# EasyEDA Pro project ESPDAP.epro

# Schematic Schematic2
Board Name: Version2; Create Date: 2025-06-18; Page Name: P1_1; Project Name: ESP_DAPLink; Schematic Name: Schematic2; Update Date: 2025-06-27; Company: 嘉立创EDA; Page Size: A4; Version: V1.0
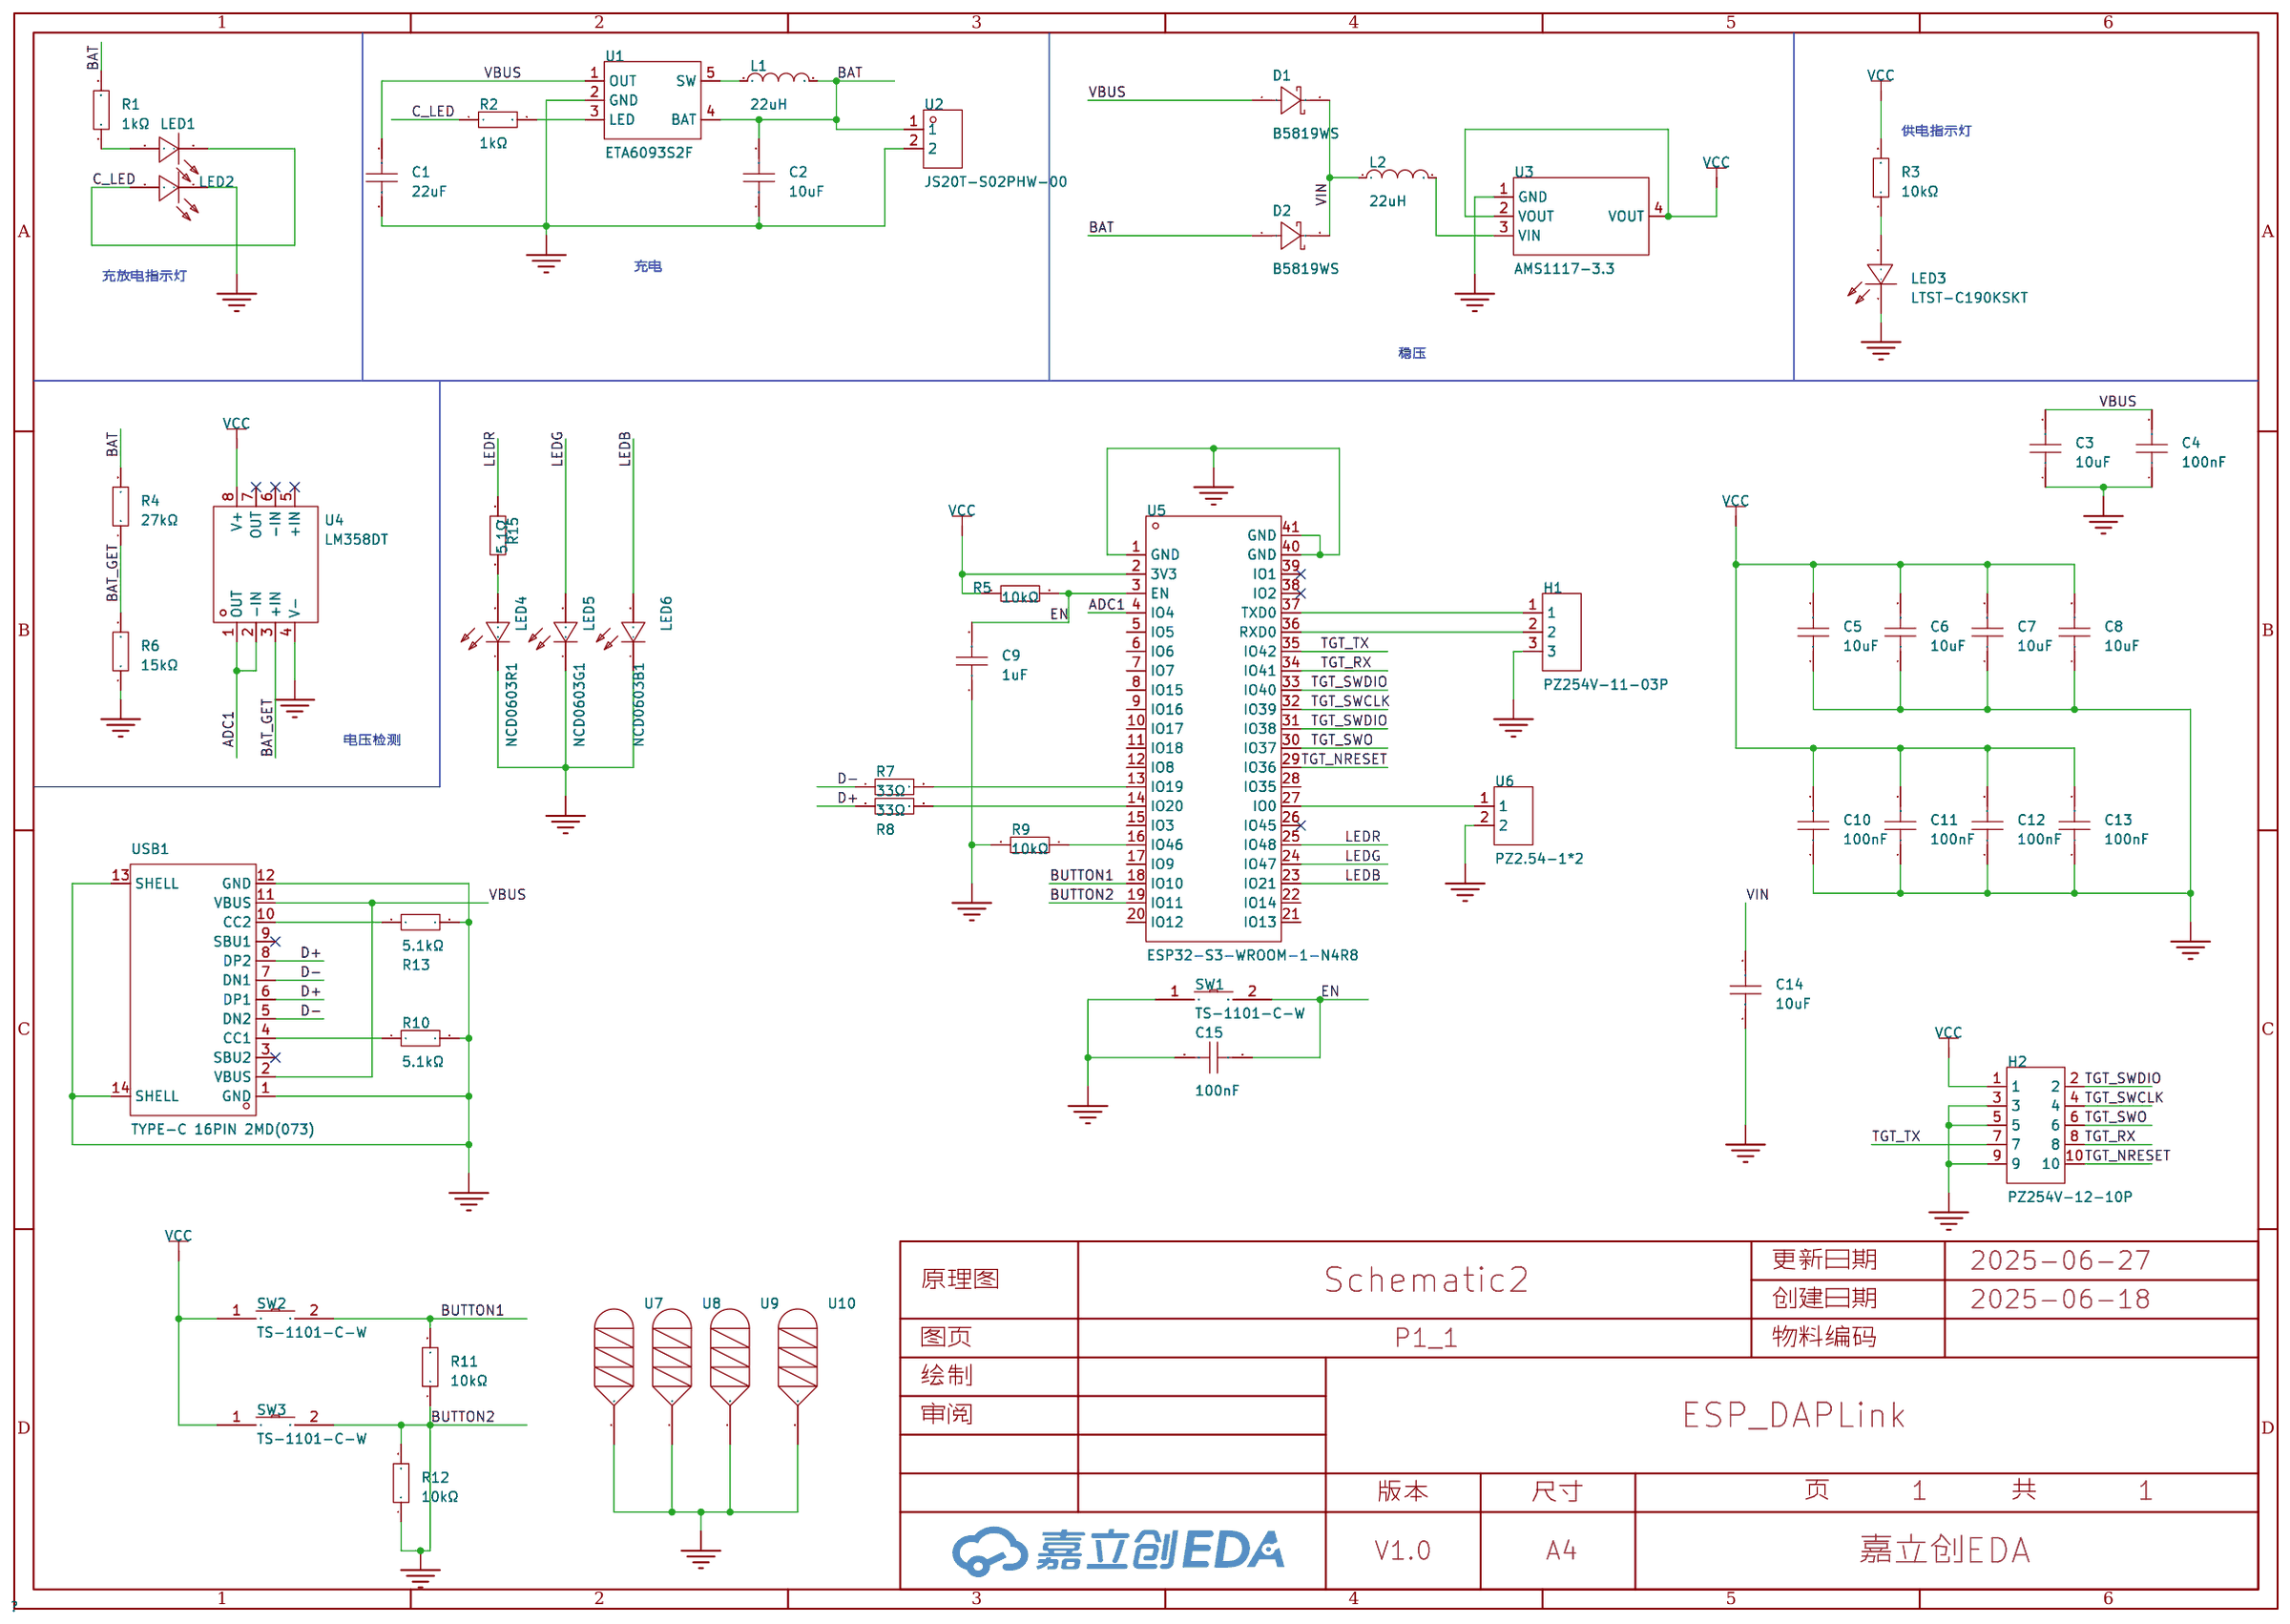
[diagram p0: schematic sheet]

## Parts
C1  22uF  [C0603]
C2  10uF  [C0603]
C3  10uF  [C0603]
C4  100nF  [C0603]
C5  10uF  [C0603]
C6  10uF  [C0603]
C7  10uF  [C0603]
C8  10uF  [C0603]
C9  1uF  [C0603]
C10  100nF  [C0603]
C11  100nF  [C0603]
C12  100nF  [C0603]
C13  100nF  [C0603]
C14  10uF  [C0603]
C15  100nF  [C0603]
D1  B5819WS  [SOD-323_L1.7-W1.3-LS2.5-FD]
D2  B5819WS  [SOD-323_L1.7-W1.3-LS2.5-FD]
H1  PZ254V-11-03P  [HDR-TH_3P-P2.54-V-M]
H2  PZ254V-12-10P  [HDR-TH_10P-P2.54-V-M-R2-C5-S2.54]
L1  22uH  [IND-SMD_L2.5-W2.0_MHCHL2520]
L2  22uH  [IND-SMD_L2.5-W2.0_MHCHL2520]
LED1  LTST-C190KSKT  [LED0603-RD]
LED2  LTST-C190KSKT  [LED0603-RD]
LED3  LTST-C190KSKT  [LED0603-RD]
LED4  NCD0603R1  [LED0603-RD_RED]
LED5  NCD0603G1  [LED0603-RD_1]
LED6  NCD0603B1  [LED0603-RD]
R1  1kΩ  [R0603]
R2  1kΩ  [R0603]
R3  10kΩ  [R0603]
R4  27kΩ  [R0603]
R5  10kΩ  [R0603]
R6  15kΩ  [R0603]
R7  33Ω  [R0603]
R8  33Ω  [R0603]
R9  10kΩ  [R0603]
R10  5.1kΩ  [R0603]
R11  10kΩ  [R0603]
R12  10kΩ  [R0603]
R13  5.1kΩ  [R0603]
R15  5.1Ω  [R0603]
SW1  TS-1101-C-W  [SW-SMD_L6.0-W3.3-LS8.0]
SW2  TS-1101-C-W  [SW-SMD_L6.0-W3.3-LS8.0]
SW3  TS-1101-C-W  [SW-SMD_L6.0-W3.3-LS8.0]
U1  ETA6093S2F  [SOT-23-5_L2.9-W1.6-P0.95-LS2.8-BL]
U2  JS20T-S02PHW-00  [CONN-TH_JS20T-S02PHW-00]
U3  AMS1117-3.3  [SOT-223-3_L6.5-W3.4-P2.30-LS7.0-BR]
U4  LM358DT  [SOIC-8_L5.0-W4.0-P1.27-LS6.0-BL]
U5  ESP32-S3-WROOM-1-N4R8  [WIRELM-SMD_ESP32-S3-WROOM-1]
U6  PZ2.54-1*2  [HDR-TH_2P-P2.54-V-M-3]
U7  -  [M2安装孔]
U8  -  [M2安装孔]
U9  -  [M2安装孔]
U10  -  [M2安装孔]
USB1  TYPE-C 16PIN 2MD(073)  [USB-C-SMD_TYPE-C-6PIN-2MD-073]

## Library data of the parts
C1 = CGA0603X5R226M160JT: 容值:22uF;精度:±20%;额定电压:16V;温度系数:X5R;; LCSC Part Name: 22uF ±20% 16V; Supplier Part: C6119868; Manufacturer: HRE(芯声); Supplier Footprint: 0603; JLCPCB Part Class: 扩展库; Datasheet: https://atta.szlcsc.com/upload/public/pdf/source/20250121/36E435B8815E1026A710792D223DB526.pdf; Supplier: LCSC; Tolerance: ±20%; Voltage Rating: 16V; Temperature Coefficient: X5R
C2 C3 C5-C8 C14 = CGA0603X5R106K100JT: 容值:10uF;精度:±10%;额定电压:10V;温度系数:X5R;; LCSC Part Name: 10uF ±10% 10V; Supplier Part: C6119842; Manufacturer: HRE(芯声); Supplier Footprint: 0603; JLCPCB Part Class: 扩展库; Supplier: LCSC; Tolerance: ±10%; Voltage Rating: 10V; Temperature Coefficient: X5R
C4 C10-C13 C15 = CGA0603X7R104K500JT: 容值:100nF;精度:±10%;额定电压:50V;温度系数:X7R;; LCSC Part Name: 100nF ±10% 50V; Supplier Part: C6119867; Manufacturer: HRE(芯声); Supplier Footprint: 0603; JLCPCB Part Class: 扩展库; Datasheet: https://atta.szlcsc.com/upload/public/pdf/source/20250103/C44077DA9E7B3EFAE02F22B6D3D1CBC9.pdf; Supplier: LCSC; Tolerance: ±10%; Voltage Rating: 50V; Temperature Coefficient: X7R
C9 = CGA0603X5R105K500JT: 容值:1uF;精度:±10%;额定电压:50V;温度系数:X5R;; LCSC Part Name: 1uF ±10% 50V; Supplier Part: C6119852; Manufacturer: HRE(芯声); Supplier Footprint: 0603; JLCPCB Part Class: 扩展库; Supplier: LCSC; Tolerance: ±10%; Voltage Rating: 50V; Temperature Coefficient: X5R
D1 D2 = B5819WS_C7420331: 二极管配置:独立式;正向压降(Vf):600mV@1.0A;直流反向耐压(Vr):40V;整流电流:1A;; LCSC Part Name: 电压:40V 电流:1A; Supplier Part: C7420331; Manufacturer: 宏迦橙; Supplier Footprint: SOD-323; JLCPCB Part Class: 扩展库; Datasheet: https://atta.szlcsc.com/upload/public/pdf/source/20230828/03CA0F4F90DAE368A7153B7B5E4D0651.pdf; Supplier: LCSC; Diode Configuration: 独立式; Forward Voltage (Vf@If): 600mV@1.0A; Reverse Voltage (Vr): 40V; Rectified Current: 1A; Reverse Leakage Current (Ir): 1mA@40V
H1 = PZ254V-11-03P: 插针结构:1x3P;间距:2.54mm;行距:-;圆针/方针:方针;安装方式:直插;排数:单排;总PIN位数:3P;额定电流:3A;额定电压:250V;配合针长度:6mm;塑高:2.5mm;端接针长度:3mm;工作温度:-40℃~+105℃;颜色:黑色;; LCSC Part Name: 1x3P 间距:2.54mm 方针 直插; Supplier Part: C2937625; Manufacturer: XFCN(兴飞); Supplier Footprint: 插件,P=2.54mm; JLCPCB Part Class: 扩展库; Datasheet: https://atta.szlcsc.com/upload/public/pdf/source/20200309/C492402_8335C3D49C4E4C618838D59BB1D024C1.pdf; Supplier: LCSC; Pin Structure: 1x3P; Pitch: 2.54mm; Circluar Pins/Square Pins: 方针; Mounting Type: 直插; Number of Rows: 单排; Number of Pins: 3P; Current Rating: 3A; Voltage Rating (Max): 250V; Length of Mating Pin: 6mm; Insulation Height: 2.5mm; Length of End Connection Pin: 3mm; Operating Temperature: -40℃~+105℃; Color: 黑色
H2 = PZ254V-12-10P: 插针结构:2x5P;间距:2.54mm;行距:2.54mm;圆针/方针:方针;安装方式:直插;排数:双排;总PIN位数:10P;额定电流:-;额定电压:-;配合针长度:6mm;塑高:2.5mm;端接针长度:3mm;触头材质:黄铜;触头镀层:-;工作温度:-40℃~+105℃;颜色:黑色;; LCSC Part Name: 2x5P 间距:2.54mm 方针 直插; Supplier Part: C492422; Manufacturer: XFCN(兴飞); Supplier Footprint: 插件,P=2.54mm; JLCPCB Part Class: 扩展库; Datasheet: https://atta.szlcsc.com/upload/public/pdf/source/20200309/C492422_5020CEA01BE7051F9EA9DD81AB0A25E3.pdf; Supplier: LCSC; Pin Structure: 2x5P; Pitch: 2.54mm; Row Spacing: 2.54mm; Circluar Pins/Square Pins: 方针; Mounting Type: 直插; Number of Rows: 双排; Number of Pins: 10P; Length of Mating Pin: 6mm; Insulation Height: 2.5mm; Length of End Connection Pin: 3mm; Contact Material: 黄铜; Operating Temperature: -40℃~+105℃; Color: 黑色
L1 L2 = FTC252010S220MBCA: 电感值:22uH;精度:±20%;额定电流:850mA;饱和电流(Isat):1.1A;类型:一体成型电感;; LCSC Part Name: 22uH ±20% 1.1A; Supplier Part: C5832391; Manufacturer: cjiang(长江微电); Supplier Footprint: SMD,2x2.5mm; JLCPCB Part Class: 扩展库; Datasheet: https://atta.szlcsc.com/upload/public/pdf/source/20230602/8FFEDA9C0247A92A0D4B67554BFE4091.pdf; Supplier: LCSC; Tolerance: ±20%; Rated Current: 850mA; Saturation Current (Isat): 1.1A; DC Resistance (DCR): 1.1Ω; Type: 一体成型电感
LED1-LED3 = LTST-C190KSKT: 发光颜色:黄色;正向电压(VF):2.1V;功率:75mW;正向电流:20mA;主波长:584.5nm~597nm;二极管配置:-;透镜颜色:无色透明透镜;色温:-;发光强度:104mcd;发光角度:130°;载带方式:-;工作温度:-30℃~+85℃;; LCSC Part Name: 黄灯; Supplier Part: C125095; Manufacturer: LITEON(光宝); Supplier Footprint: 0603; JLCPCB Part Class: 扩展库; Datasheet: https://atta.szlcsc.com/upload/public/pdf/source/20180129/C125095_15171881843821315881.pdf; Supplier: LCSC; Emitted Color: 黄色; Forward Voltage (VF): 2.1V; Power Dissipation: 75mW; Forward Current: 20mA; Dominant Wavelength: 584.5nm~597nm; Peak Wavelength: 588nm; Lens Color: 无色透明透镜; Luminous Intensity: 104mcd; Viewing Angle: 130°; Operating Temperature: -30℃~+85℃
LED4 = NCD0603R1_C84263: 灯头类型:-;发光颜色:红色;正向压降(Vf):1.6V~2.6V;功率:65mW;正向电流:25mA;波长:615nm~630nm;二极管配置:独立二极管;透镜颜色:-;色温:-;发光强度:80mcd~220mcd;发光角度:130°;载带方式:-;工作温度:-30℃~+85℃;; Supplier Part: C84263; Manufacturer: 国星光电; Supplier Footprint: 0603; JLCPCB Part Class: 扩展库; Datasheet: https://atta.szlcsc.com/upload/public/pdf/source/20200820/C84263_DABC6A75E58F576973B407FDBA283D60.pdf; Supplier: LCSC; Illumination Color: 红色; Voltage - Forward(Vf): 1.6V~2.6V; Power(Watts): 65mW; Forward Current: 25mA; Wavelength - Dominant: 615nm~630nm; Diode Configuration: 独立二极管; Luminous Intensity: 80mcd~220mcd; Viewing Angle: 130°; Operating Temperature: -30℃~+85℃
LED5 = NCD0603G1: 发光颜色:翠绿色;正向压降(Vf):2.6V~3.6V;功率:72mW;正向电流:20mA;波长:515nm~530nm;透镜颜色:-;发光强度:330mcd~900mcd;发光角度:130°;工作温度:-30℃~+85℃;; Supplier Part: C84267; Manufacturer: 国星光电; Supplier Footprint: 0603; JLCPCB Part Class: 扩展库; Datasheet: https://atta.szlcsc.com/upload/public/pdf/source/20200820/C84267_04BA7703640BAC111D09F5EFB971FBF3.pdf; Supplier: LCSC; Illumination Color: 翠绿色; Voltage - Forward(Vf): 2.6V~3.6V; Power(Watts): 72mW; Forward Current: 20mA; Wavelength - Dominant: 515nm~530nm; Luminous Intensity: 330mcd~900mcd; Viewing Angle: 130°; Operating Temperature: -30℃~+85℃
LED6 = NCD0603B1: 灯头类型:-;发光颜色:-;正向压降(Vf):2.6V~3.6V;功率:72mW;正向电流:10mA;波长:463nm~475nm;二极管配置:-;透镜颜色:-;色温:-;发光强度:80mcd~220mcd;发光角度:130°;载带方式:-;工作温度:-30℃~+85℃;; Supplier Part: C84266; Manufacturer: 国星光电; Supplier Footprint: 0603; JLCPCB Part Class: 扩展库; Datasheet: https://atta.szlcsc.com/upload/public/pdf/source/20200820/C84266_6A3CDBEFA72C6CAD68EDA53474ADAE6C.pdf; Supplier: LCSC; Voltage - Forward(Vf): 2.6V~3.6V; Power(Watts): 72mW; Forward Current: 10mA; Wavelength - Dominant: 463nm~475nm; Luminous Intensity: 80mcd~220mcd; Viewing Angle: 130°; Operating Temperature: -30℃~+85℃
R1 R2 = 0603WAF1001T5E: 电阻类型:厚膜电阻;阻值:1kΩ;精度:±1%;功率:100mW;最大工作电压:75V;温度系数:±100ppm/℃;; LCSC Part Name: 1kΩ ±1% 100mW 厚膜电阻; Supplier Part: C21190; Manufacturer: UNI-ROYAL(厚声); Supplier Footprint: 0603; JLCPCB Part Class: 基础库; Datasheet: https://atta.szlcsc.com/upload/public/pdf/source/20200306/C422600_1E6D84923E4A46A82E41ADD87F860B5C.pdf; Supplier: LCSC; Type: 厚膜电阻; Tolerance: ±1%; Power(Watts): 100mW; Overload Voltage (Max): 75V; Temperature Coefficient: ±100ppm/℃; Operating Temperature Range: -55℃~+155℃
R3-R6 R9 R11 R12 = 0603WAF1002T5E: 电阻类型:厚膜电阻;阻值:10kΩ;精度:±1%;功率:100mW;最大工作电压:75V;温度系数:±100ppm/℃;; LCSC Part Name: 厚膜电阻 10kΩ ±1% 100mW; Supplier Part: C25804; Manufacturer: UNI-ROYAL(厚声); Supplier Footprint: 0603; JLCPCB Part Class: 基础库; Datasheet: https://atta.szlcsc.com/upload/public/pdf/source/20200306/C422600_1E6D84923E4A46A82E41ADD87F860B5C.pdf; Supplier: LCSC; Type: 厚膜电阻; Tolerance: ±1%; Power(Watts): 100mW; Overload Voltage (Max): 75V; Temperature Coefficient: ±100ppm/℃; Operating Temperature Range: -55℃~+155℃
R7 R8 = 0603WAF330JT5E: 电阻类型:厚膜电阻;阻值:33Ω;精度:±1%;功率:100mW;最大工作电压:75V;温度系数:±100ppm/℃;; LCSC Part Name: 33Ω ±1% 100mW 厚膜电阻; Supplier Part: C23140; Manufacturer: UNI-ROYAL(厚声); Supplier Footprint: 0603; JLCPCB Part Class: 基础库; Datasheet: https://atta.szlcsc.com/upload/public/pdf/source/20200306/C422600_1E6D84923E4A46A82E41ADD87F860B5C.pdf; Supplier: LCSC; Type: 厚膜电阻; Tolerance: ±1%; Power(Watts): 100mW; Overload Voltage (Max): 75V; Temperature Coefficient: ±100ppm/℃; Operating Temperature Range: -55℃~+155℃
R10 R13 = 0603WAF5101T5E: 电阻类型:厚膜电阻;阻值:5.1kΩ;精度:±1%;功率:100mW;最大工作电压:75V;温度系数:±100ppm/℃;; LCSC Part Name: 5.1kΩ ±1% 100mW 厚膜电阻; Supplier Part: C23186; Manufacturer: UNI-ROYAL(厚声); Supplier Footprint: 0603; JLCPCB Part Class: 基础库; Datasheet: https://atta.szlcsc.com/upload/public/pdf/source/20200306/C422600_1E6D84923E4A46A82E41ADD87F860B5C.pdf; Supplier: LCSC; Type: 厚膜电阻; Tolerance: ±1%; Power(Watts): 100mW; Overload Voltage (Max): 75V; Temperature Coefficient: ±100ppm/℃; Operating Temperature Range: -55℃~+155℃
R15 = 0603WAF510KT5E: 电阻类型:厚膜电阻;阻值:5.1Ω;精度:±1%;功率:100mW;最大工作电压:75V;温度系数:±200ppm/℃;; LCSC Part Name: 5.1Ω ±1% 100mW 厚膜电阻; Supplier Part: C25197; Manufacturer: UNI-ROYAL(厚声); Supplier Footprint: 0603; JLCPCB Part Class: 基础库; Datasheet: https://atta.szlcsc.com/upload/public/pdf/source/20200306/C422600_1E6D84923E4A46A82E41ADD87F860B5C.pdf; Supplier: LCSC; Type: 厚膜电阻; Tolerance: ±1%; Power(Watts): 100mW; Overload Voltage (Max): 75V; Temperature Coefficient: ±200ppm/℃; Operating Temperature Range: -55℃~+155℃
SW1-SW3 = TS-1101-C-W: 电路结构:单刀单掷;按钮形状:矩形按钮;作用力:260gf;安装方式:立贴;开关长度:6mm;开关宽度:3.6mm;开关高度:2.5mm;带支架:不带;触点电流:50mA;额定电压(AC):-;额定电压(DC):12V;额定功率:-;绝缘电阻:-;带灯:无;机械寿命:5万次;; LCSC Part Name: 6*3.6*2.5mm 立贴 轻触开关; Supplier Part: C318938; Manufacturer: XKB Connectivity(中国星坤); Supplier Footprint: SMD; JLCPCB Part Class: 扩展库; Datasheet: https://atta.szlcsc.com/upload/public/pdf/source/20200227/C318938_C2E53B1EEDE37D980A33616AC086DE53.pdf; Supplier: LCSC; Circuit: 单刀单掷; Actuator Style: 矩形按钮; Operating Force: 260gf; Mounting Style: 立贴; Switch Length: 6mm; Switch Width: 3.6mm; Switch Height: 2.5mm; Strike Gundam: 不带; Contact Current: 50mA; Voltage Rating (DC): 12V; Actuator/Cap Color: 白色带淡绿; With Lamp: 无; Mechanical Life: 5万次; Operating Temperature: -30℃~+85℃
U1 = ETA6093S2F: Supplier Part: C19100570; Manufacturer: ETA(钰泰); Supplier Footprint: SOT-23-5; JLCPCB Part Class: 扩展库; Datasheet: https://atta.szlcsc.com/upload/public/pdf/source/20250320/2283854BFD7DF703855BC7A157F00EBF.pdf; Supplier: LCSC
U2 = JS20T-S02PHW-00: 插针结构:1x2P;间距:2mm;安装方式:弯插;参考系列:PH;总PIN数:2P;排数:1;每排PIN数:2;触头材质:黄铜;; Supplier Part: C7499302; Manufacturer: JS(钜硕电子); Supplier Footprint: 插件,P=2.0mm; JLCPCB Part Class: 扩展库; Datasheet: https://atta.szlcsc.com/upload/public/pdf/source/20230809/E6337CD797A912ED7011A9EA7A78FFDE.pdf; Supplier: LCSC; Pins Structure: 1x2P; Pitch: 2mm; Mounting Style: 弯插; Reference Series: PH; Number of Pins: 2P; Number of Rows: 1; Number of PINs Per Row: 2; Contact Material: 黄铜
U3 = AMS1117-3.3_C6186: 输出类型:固定;工作电压:-;输出电压:3.3V;输出电流:1A;电源纹波抑制比(PSRR):72dB@(120Hz);输出极性:正极;; LCSC Part Name: 输出3.3V 1A; Supplier Part: C6186; Manufacturer: AMS; Supplier Footprint: SOT-223; JLCPCB Part Class: 基础库; Datasheet: https://atta.szlcsc.com/upload/public/pdf/source/20180727/C6186_7A095716F0823C02F1997A905E26C086.pdf; Supplier: LCSC; Output Type: 固定; Output Voltage: 3.3V; Output Current: 1A; Power Supply Rejection Ratio (PSRR): 72dB@(120Hz); Voltage Dropout: 1.3V@(800mA); Features: 过流保护(OCP)；热关断(TSD); Output Configuration: 正极; Number of Outputs: 1
U4 = LM358DT: 放大器数:双路;轨到轨:-;增益带宽积(GBP):800kHz;输入失调电压(Vos):7mV;压摆率(SR):0.6V/us;输入偏置电流(Ib):20nA;; LCSC Part Name: 低功耗双运算放大器，低输入偏置电流; Supplier Part: C9418; Manufacturer: ST(意法半导体); Supplier Footprint: SOIC-8; JLCPCB Part Class: 扩展库; Datasheet: https://atta.szlcsc.com/upload/public/pdf/source/20140724/1457707175115.pdf; Supplier: LCSC; Number of Circuits: 双路; Maximum Power Supply Range (Vdd-Vss): 30V; Gain Bandwidth Product(GBP): 800kHz; Voltage - Input Offset(Vos): 7mV; Input Offset Voltage Drift (Vos TC): 30uV/℃; Slew Rate(SR): 0.6V/us; Current - Input Bias(Ib): 20nA; Noise density(eN): 55nV/√Hz@1kHz; Common Mode Rejection Ratio (CMRR): 85dB; Quiescent Current: 700uA; Output Current: 30mA; Operating Temperature: 0℃~+70℃
U5 = ESP32-S3-WROOM-1-N4R8: LCSC Part Name: 通用型Wi-Fi+低功耗蓝牙MCU模组; Supplier Part: C2913200; Manufacturer: ESPRESSIF(乐鑫); Supplier Footprint: SMD,18x25.5mm; JLCPCB Part Class: 扩展库; Datasheet: https://atta.szlcsc.com/upload/public/pdf/source/20241030/6A412B13087E1327DF6279F5735253CA.pdf; Supplier: LCSC
U6 = PZ2.54-1*2: Supplier Part: C5360898; Manufacturer: ZHOURI(洲日); Supplier Footprint: 插件,P=2.54mm; JLCPCB Part Class: 扩展库; Datasheet: https://atta.szlcsc.com/upload/public/pdf/source/20250227/F941FC765EF241ABFB2D5D72948A31A5.pdf; Supplier: LCSC
U7-U10 = M2安装孔
USB1 = TYPE-C 16PIN 2MD(073): 连接器类型:Type-C;标准:USB 3.1;公母:母;安装方式:卧贴;触点数量:16P;端口数量:1;额定电流 - 电源:5A;工作温度范围:-25℃~+85℃;; LCSC Part Name: Type-C 母 卧贴; Supplier Part: C2765186; Manufacturer: SHOU HAN(首韩); Supplier Footprint: SMD; JLCPCB Part Class: 扩展库; Datasheet: https://atta.szlcsc.com/upload/public/pdf/source/20211123/39B17C16241EAC15C5E277BDA434118E.pdf; Supplier: LCSC; Connector Type: Type-C; Standard: USB 3.1; Gender: 母; Mounting Style: 卧贴; Number of Contacts: 16P; Number of Ports: 1; Current Rating - Power (Max): 5A; Operating Temperature Range: -25℃~+85℃; Rated Voltage (Max): 5V; Connect-Disconnect Life: 5千次; Core Colour: 黑色

## Nets
GND: C1.1 C2.1 C3.1 C4.1 C5.1 C6.1 C7.1 C8.1 C9.1 C10.1 C11.1 C12.1 C13.1 C14.1 C15.2 H1.3 H2.3 H2.5 H2.9 LED2.1(-) LED3.1(-) LED4.1(K) LED5.1(K) LED6.1(-) R6.1 R9.2 R10.2 R11.1 R12.1 R13.2 SW1.1 U1.2(GND) U2.2 U3.1(GND) U4.4(V-) U5.1(GND) U5.40(GND) U5.41(GND) U6.2 U7.1 U8.1 U9.1 U10.1 USB1.1(GND) USB1.12(GND) USB1.13(SHELL) USB1.14(SHELL)
VBUS: C1.2 C3.2 C4.2 D1.1(A) U1.1(OUT) USB1.2(VBUS) USB1.11(VBUS)
VCC: C5.2 C6.2 C7.2 C8.2 C10.2 C11.2 C12.2 C13.2 H2.1 R3.2 R5.1 SW2.1 SW3.1 U3.2(VOUT) U3.4(VOUT) U4.8(V+) U5.2(3V3)
VIN: C14.2 D1.2(K) D2.2(K) L2.1
ADC1: U4.1(OUT) U4.2(-IN) U5.4(IO4)
BAT: C2.2 D2.1(A) L1.2 R1.2 R4.2 U1.4(BAT) U2.1
BAT_GET: R4.1 R6.2 U4.3(+IN)
BUTTON1: R11.2 SW2.2 U5.18(IO10)
BUTTON2: R12.2 SW3.2 U5.19(IO11)
C_LED: LED1.1(-) LED2.2(+) R2.1
D+: R8.1 USB1.6(DP1) USB1.8(DP2)
D-: R7.1 USB1.5(DN2) USB1.7(DN1)
EN: C9.2 C15.1 R5.2 SW1.2 U5.3(EN)
LEDB: LED6.2(+) U5.23(IO21)
LEDG: LED5.2(A) U5.24(IO47)
LEDR: R15.2 U5.25(IO48)
TGT_NRESET: H2.10 U5.29(IO36)
TGT_RX: H2.8 U5.34(IO41)
TGT_SWCLK: H2.4 U5.32(IO39)
TGT_SWDIO: H2.2 U5.31(IO38) U5.33(IO40)
TGT_SWO: H2.6 U5.30(IO37)
TGT_TX: H2.7 U5.35(IO42)
$3N791: L1.1 U1.5(SW)
$3N922: R2.2 U1.3(LED)
$3N2688: LED3.2(+) R3.1
$3N4196: R7.2 U5.13(IO19)
$3N4199: R8.2 U5.14(IO20)
$3N4756: U5.27(IO0) U6.1
$3N4867: H1.1 U5.37(TXD0)
$3N4870: H1.2 U5.36(RXD0)
$3N5281: R9.1 U5.16(IO46)
$3N6239: LED1.2(+) R1.1
$3N15872: L2.2 U3.3(VIN)
$3N15883: R13.1 USB1.10(CC2)
$3N15888: R10.1 USB1.4(CC1)
$3N17783: LED4.2(A) R15.1

Not connected (* = marked no-connect by the designer): U4 5(+IN)* 6(-IN)* 7(OUT)*; U5 5(IO5) 6(IO6) 7(IO7) 8(IO15) 9(IO16) 10(IO17) 11(IO18) 12(IO8) 15(IO3) 17(IO9) 20(IO12) 21(IO13) 22(IO14) 26(IO45)* 28(IO35) 38(IO2)* 39(IO1)*; USB1 3(SBU2)* 9(SBU1)*

## Notes on the sheet
- 供电指示灯
- 充电
- 充放电指示灯
- 稳压
- 电压检测

# Board PCB2
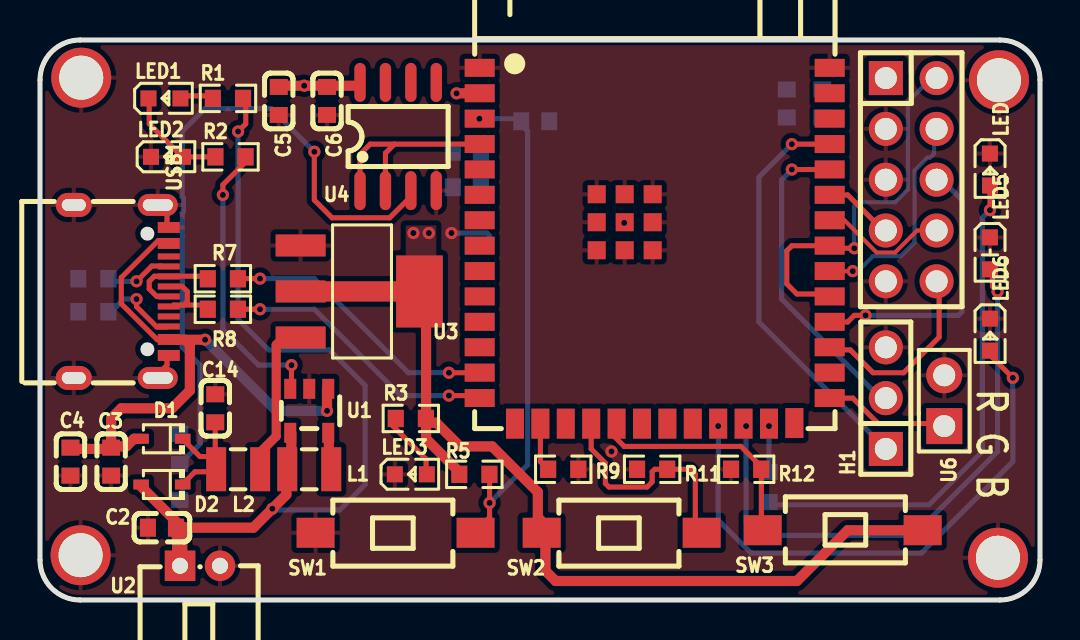
[diagram p1: board, top side]
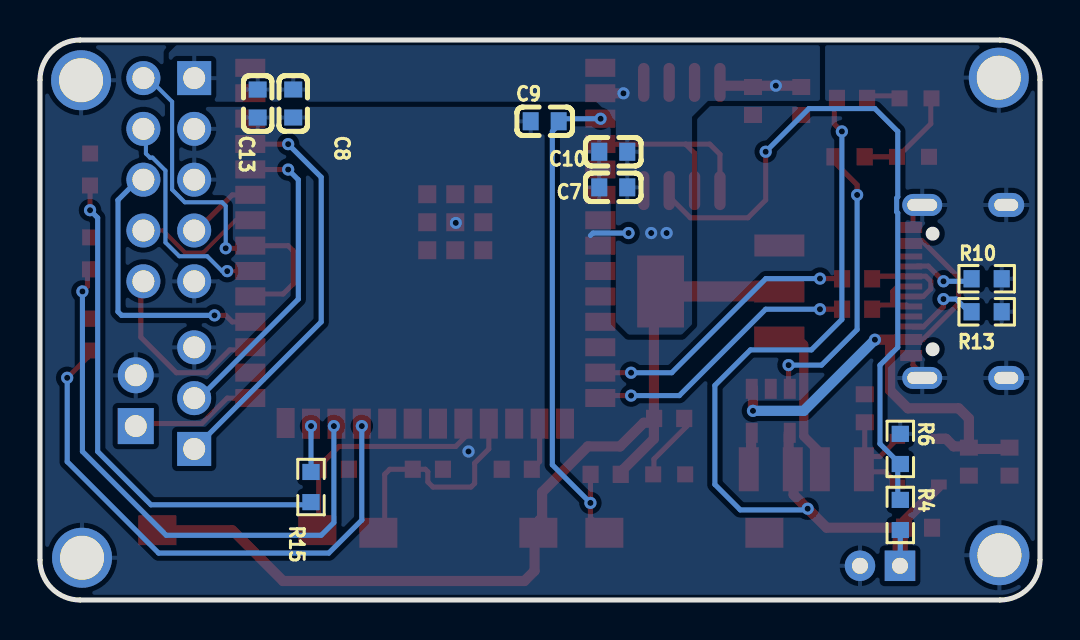
[diagram p2: board, bottom side, seen from below]

Outline 50 x 28 mm; copper layers: Top Layer, Bottom Layer. Coordinates in mm from the lower left corner of the outline.
Outline path: 0,26 0,2 arc(0.59,0.59) 2,0 48,0 arc(49.41,0.59) 50,2 50,26 arc(49.41,27.41) 48,28 2,28 arc(0.59,27.41) 0,26
Stack: Top Layer 0.035mm / Dielectric1 1.51mm FR4 er 4.5 / Bottom Layer 0.035mm

## Design rules (mm)
template: JLCPCB Capability(Two Layers Board)
spacing copperThickness1oz (default): track to track 0.102, other pairs 0.152 to 0.3
spacing copperThickness2oz: track to track 0.203, other pairs 0.152 to 0.3
track width copperThickness1oz (default): min 0.127, default 0.254, max 2.54
track width copperThickness2oz: min 0.203, default 0.254, max 2.54
differential pair differentialPair (default): width min 0.127, default 0.254, max 2.54; gap min 0.152, default 0.152
via viaSize (default): diameter min 0.5, default 0.61, max 10; hole min 0.3, default 0.305, max 6.3

## Placement (name value [footprint] x y rotation side)
C2  10uF  [C0603]  6.1 3.62 0 top
C3  10uF  [C0603]  3.56 6.92 90 top
C4  100nF  [C0603]  1.52 6.92 90 top
C5  10uF  [C0603]  11.94 24.95 90 top
C6  10uF  [C0603]  14.35 24.95 90 top
C7  10uF  [C0603]  21.34 20.63 180 bottom
C8  10uF  [C0603]  37.34 24.83 90 bottom
C9  1uF  [C0603]  24.76 23.94 180 bottom
C10  100nF  [C0603]  21.34 22.41 180 bottom
C13  100nF  [C0603]  39.12 24.83 90 bottom
C14  10uF  [C0603]  8.76 9.58 270 top
D1  B5819WS  [SOD-323_L1.7-W1.3-LS2.5-FD]  6.1 8.06 0 top
D2  B5819WS  [SOD-323_L1.7-W1.3-LS2.5-FD]  6.1 5.78 0 top
H1  PZ254V-11-03P  [HDR-TH_3P-P2.54-V-M]  42.29 10.09 90 top
H2  PZ254V-12-10P  [HDR-TH_10P-P2.54-V-M-R2-C5-S2.54]  43.56 21.02 270 top
L1  22uH  [IND-SMD_L2.5-W2.0_MHCHL2520]  13.46 6.54 180 top
L2  22uH  [IND-SMD_L2.5-W2.0_MHCHL2520]  9.91 6.54 0 top
LED1  LTST-C190KSKT  [LED0603-RD]  6.22 25.08 0 top
LED2  LTST-C190KSKT  [LED0603-RD]  6.35 22.16 0 top
LED3  LTST-C190KSKT  [LED0603-RD]  18.54 6.28 0 top
LED4  NCD0603R1  [LED0603-RD_RED]  47.5 21.52 270 top
LED5  NCD0603G1  [LED0603-RD_1]  47.5 17.33 270 top
LED6  NCD0603B1  [LED0603-RD]  47.5 13.27 270 top
R1  1kΩ  [R0603]  9.4 25.08 0 top
R2  1kΩ  [R0603]  9.53 22.16 0 top
R3  10kΩ  [R0603]  18.54 9.08 0 top
R4  27kΩ  [R0603]  6.98 4.25 270 bottom
R5  10kΩ  [R0603]  21.72 6.28 0 top
R6  15kΩ  [R0603]  6.98 7.55 270 bottom
R7  33Ω  [R0603]  9.14 16.06 0 top
R8  33Ω  [R0603]  9.14 14.54 0 top
R9  10kΩ  [R0603]  26.16 6.54 0 top
R10  5.1kΩ  [R0603]  2.67 16.06 180 bottom
R11  10kΩ  [R0603]  30.61 6.54 0 top
R12  10kΩ  [R0603]  35.31 6.54 0 top
R13  5.1kΩ  [R0603]  2.67 14.41 180 bottom
R15  5.1Ω  [R0603]  36.45 5.65 90 bottom
SW1  TS-1101-C-W  [SW-SMD_L6.0-W3.3-LS8.0]  17.78 3.36 0 top
SW2  TS-1101-C-W  [SW-SMD_L6.0-W3.3-LS8.0]  29.08 3.36 0 top
SW3  TS-1101-C-W  [SW-SMD_L6.0-W3.3-LS8.0]  40.13 3.49 180 top
U1  ETA6093S2F  [SOT-23-5_L2.9-W1.6-P0.95-LS2.8-BL]  13.46 9.46 180 top
U2  JS20T-S02PHW-00  [CONN-TH_JS20T-S02PHW-00]  8 1.71 0 top
U3  AMS1117-3.3  [SOT-223-3_L6.5-W3.4-P2.30-LS7.0-BR]  16 15.43 180 top
U4  LM358DT  [SOIC-8_L5.0-W4.0-P1.27-LS6.0-BL]  17.91 23.17 0 top
U5  ESP32-S3-WROOM-1-N4R8  [WIRELM-SMD_ESP32-S3-WROOM-1]  30.73 17.71 0 top
U6  PZ2.54-1*2  [HDR-TH_2P-P2.54-V-M-3]  45.21 9.97 90 top
U7  -  [M2安装孔]  2.06 26.12 0 top
U8  -  [M2安装孔]  2.03 2.24 0 top
U9  -  [M2安装孔]  47.95 25.99 0 top
U10  -  [M2安装孔]  47.9 2.11 0 top
USB1  TYPE-C 16PIN 2MD(073)  [USB-C-SMD_TYPE-C-6PIN-2MD-073]  4.06 15.43 270 top

## Footprints (pads in the part's own frame, mm; a bottom-side part is the same pattern mirrored in y, then rotated)
C0603
  rect 0.8x0.9 smd: 1(-0.7,0) 2(0.7,0)
CONN-TH_JS20T-S02PHW-00
  rect 1.524x1.524 hole 0.8: 1(-1,0)
  round 1.524 hole 0.8: 2(1,0)
HDR-TH_2P-P2.54-V-M-3
  rect 1.8x1.8 hole 1.1: 1(-1.27,0)
  round 1.8 hole 1.1: 2(1.27,0)
HDR-TH_3P-P2.54-V-M
  rect 1.7x1.7 hole 1.1: 1(-2.54,0)
  round 1.7 hole 1.1: 2(0,0) 3(2.54,0)
HDR-TH_10P-P2.54-V-M-R2-C5-S2.54
  rect 1.7x1.7 hole 1.1: 1(-5.08,-1.27)
  round 1.7 hole 1.1: 2(-5.08,1.27) 3(-2.54,-1.27) 4(-2.54,1.27) 5(0,-1.27) 6(0,1.27) 7(2.54,-1.27) 8(2.54,1.27) 9(5.08,-1.27) 10(5.08,1.27)
IND-SMD_L2.5-W2.0_MHCHL2520
  rect 1x2.2 smd: 1(-1.1,0) 2(1.1,0)
LED0603-RD
  rect 0.8x0.8 smd: 1(-0.799,0) 2(0.799,0)
LED0603-RD_1
  rect 0.8x0.8 smd: 1(-0.799,-0.004) 2(0.799,0.004)
LED0603-RD_RED
  rect 0.8x0.8 smd: 1(-0.799,-0.004) 2(0.799,0.004)
M2安装孔
  round 3 hole 2.2: 1(0,0)
R0603
  rect 0.806x0.864 smd: 1(-0.753,0) 2(0.753,0)
SOD-323_L1.7-W1.3-LS2.5-FD
  rect 0.78x0.5 smd: 1(-1.04,0) 2(1.04,0)
SOIC-8_L5.0-W4.0-P1.27-LS6.0-BL
  oval 0.569x1.95 smd: 1(-1.905,-2.705) 2(-0.635,-2.705) 3(0.635,-2.705) 4(1.905,-2.705) 5(1.905,2.705) 6(0.635,2.705) 7(-0.635,2.705) 8(-1.905,2.705)
SOT-23-5_L2.9-W1.6-P0.95-LS2.8-BL
  rect 0.6x1 smd: 1(-0.95,-1.1) 2(0,-1.1) 3(0.95,-1.1) 4(0.95,1.1) 5(-0.95,1.1)
SOT-223-3_L6.5-W3.4-P2.30-LS7.0-BR
  rect 2.5x1.1 smd: 1(2.97,-2.3) 2(2.97,0) 3(2.97,2.3)
  rect 2.34x3.6 smd: 4(-2.97,0)
SW-SMD_L6.0-W3.3-LS8.0
  rect 1.9x1.5 smd: 1(-4,0) 2(4,0)
USB-C-SMD_TYPE-C-6PIN-2MD-073
  rect 0.55x1.1 smd: 1(-3.2,2.375) 2(-2.4,2.375) 11(2.4,2.375) 12(3.2,2.375)
  rect 0.3x1.1 smd: 3(-1.75,2.375) 4(-1.25,2.375) 5(-0.75,2.375) 6(-0.25,2.375) 7(0.25,2.375) 8(0.75,2.375) 9(1.25,2.375) 10(1.75,2.375)
  oval 1.1x2 hole 0.6x1.5: 13(-4.325,1.825) 14(4.325,1.825)
  oval 1.2x1.8 hole 0.6x1.2: 13(-4.325,-2.375) 14(4.325,-2.375)
WIRELM-SMD_ESP32-S3-WROOM-1
  rect 1.5x0.9 smd: 1(-8.75,8.895) 2(-8.75,7.625) 3(-8.75,6.355) 4(-8.75,5.085) 5(-8.75,3.815) 6(-8.75,2.545) 7(-8.75,1.275) 8(-8.75,0.005) 9(-8.75,-1.265) 10(-8.75,-2.535) 11(-8.75,-3.805) 12(-8.75,-5.075) 13(-8.75,-6.345) 14(-8.75,-7.615) 27(8.75,-7.615) 28(8.75,-6.345) 29(8.75,-5.075) 30(8.75,-3.805) 31(8.75,-2.535) 32(8.75,-1.265) 33(8.75,0.005) 34(8.75,1.275) 35(8.75,2.545) 36(8.75,3.815) 37(8.75,5.085) 38(8.75,6.355) 39(8.75,7.625) 40(8.75,8.895)
  rect 0.9x1.5 smd: 15(-6.985,-8.895) 16(-5.715,-8.895) 17(-4.445,-8.895) 18(-3.175,-8.895) 19(-1.905,-8.895) 20(-0.635,-8.895) 21(0.635,-8.895) 22(1.905,-8.895) 23(3.175,-8.895) 24(4.445,-8.895) 25(5.715,-8.895) 26(6.985,-8.865)
  rect 0.9x0.9 smd: 41(-2.9,2.575) 41(-2.9,1.175) 41(-2.9,-0.225) 41(-1.5,2.575) 41(-1.5,1.175) 41(-1.5,-0.225) 41(-0.1,2.575) 41(-0.1,1.175) 41(-0.1,-0.225)

## Nets
As in the schematic.

Pads without a net: U4 5 6 7; U5 5 6 7 8 9 10 11 12 15 17 20 21 22 26 28 38 39; USB1 3 9

## Via types
v1: diameter 0.61, hole 0.305, Top Layer to Bottom Layer, 33 vias

## Routing (per net, layer and track width the routed paths; a pad name or vN(x,y) marks a point on that pad's centre or on a via; arc(x,y) is an arc through that point)
GND: length 4.3
  Top Layer w0.254: 5.84,11.24 6.35,11.74 6.35,12.25 ; 6.35,18.6 6.35,19.36 6.1,19.62
  Bottom Layer w0.254: v1(20.57,18.35) 22.35,18.35 22.48,18.22
  vias: v1(28.57,7.43) v1(29.21,18.86)
VBUS: length 29.8
  Top Layer w0.254: 6.22,13.01 5.86,13.01 4.06,14.81 4.06,16.12 5.91,17.97 6.1,17.97 ; 1.4,7.68 1.65,7.68 1.65,7.55
  Top Layer w0.508: 1.65,7.68 1.78,7.55 3.56,7.55 3.56,9.08 4.06,9.58 6.6,9.58 7.49,10.47 7.49,12.76 7.24,13.01 ; v1(14.35,9.46) 14.35,10.6 ; 5.08,8.06 4.7,8.06 4.32,7.68 3.68,7.68 ; 7.24,13.01 v1(8.25,13.01) ; 7.24,13.01 6.71,13.01
  Bottom Layer w0.508: v1(14.35,9.46) 11.81,9.46 v1(8.25,13.01)
VCC: length 49.8
  Top Layer w0.508: 16,25.84 15.88,25.71 14.48,25.71 ; 20.96,6.41 19.3,8.06 19.3,14.28 19.43,14.41 ; 12.19,25.71 v1(13.21,25.71) 14.03,25.71 14.1,25.65 ; 19.3,8.86 19.81,8.86 21,7.68 22.61,7.68 24.89,5.39 24.89,4.12 25.02,4 25.02,3.49 ; 22.1,25.33 v1(20.83,25.33) ; 25.27,2.85 25.27,1.46 25.78,0.95 37.85,0.95 40.39,3.49 44.45,3.49
  Top Layer w1.016: 13.59,15.43 19.05,15.43
  vias: v1(18.67,18.35) v1(19.44,18.35)
VIN: length 5.9
  Top Layer w0.254: 8.76,6.41 7.75,6.41 7.11,5.78 ; 7.11,8.06 8,7.17 8.89,7.17 8.76,7.3 8.76,8.95
ADC1: length 10.4
  Top Layer w0.254: 21.97,22.67 21.84,22.79 17.72,22.79 ; 17.72,22.79 17.27,22.34 17.27,20.63 ; 17.72,22.79 16.51,22.79 16,22.28 16,20.51
BAT: length 44.7
  Top Layer w0.254: 10.29,24.7 10.29,23.81 v1(9.91,23.43) ; 6.73,3.62 6.98,3.62
  Top Layer w0.508: 12.45,6.66 12.57,6.79 12.57,8.32 ; 6.98,3.62 10.67,3.62 v1(11.62,4.56) 12.32,5.27 12.32,6.66 ; 6.98,3.74 5.08,5.65
  Top Layer w0.762: 6.98,1.71 6.98,3.62
  Bottom Layer w0.254: 6.98,1.58 6.98,3.49 7.11,3.62 ; v1(11.62,4.56) 11.68,4.5 14.99,4.5 16.26,5.78 16.26,10.73 14.48,12.51 11.43,12.51 9.91,14.03 v1(9.91,23.43)
BAT_GET: length 35.2
  Top Layer w0.254: 18.41,20.13 18.41,20.04 17.48,19.11 14.6,19.11 13.72,20 v1(13.72,22.41)
  Bottom Layer w0.254: 7.11,5.01 7.11,6.66 6.98,6.79 8,7.81 8,11.74 7.11,12.63 7.11,19.35 7.17,19.41 7.17,20.1 7.11,20.15 7.11,23.43 8.25,24.57 11.56,24.57 v1(13.72,22.41)
BUTTON1: length 11.4
  Top Layer w0.254: 31.37,6.54 30.73,6.54 30.61,6.41 30.61,5.9 30.35,5.65 28.45,5.65 28.27,5.83 28.27,6.84 27.56,7.55 27.56,8.7 ; 31.5,6.54 32.51,6.54 32.77,6.28 32.77,3.23
BUTTON2: length 10.9
  Top Layer w0.254: 36.07,6.66 35.05,7.68 29.21,7.68 28.7,8.19 28.7,8.31 ; 36.07,3.74 36.07,6.54
C_LED: length 4.7
  Top Layer w0.254: 7.37,22.16 8.51,22.16 8.64,22.28 ; 5.46,25.08 5.46,23.81 6.98,22.28
D+: length 3.3
  Top Layer w0.254: 6.6,14.67 6.69,14.75 7.19,14.75 ; 6.73,15.68 7.11,15.68 7.37,15.43 7.37,14.93 7.19,14.75 ; 7.19,14.75 8.3,14.75 8.38,14.67
D-: length 4.5
  Top Layer w0.254: 6.35,15.17 5.84,15.17 5.46,15.55 5.46,15.94 5.72,16.19 8.25,16.19 8.38,16.06
EN: length 25.2
  Top Layer w0.254: 21.84,3.49 22.48,4.12 v1(22.48,4.86) 22.48,6.41
  Bottom Layer w0.254: v1(21.97,24.06) 23.75,24.06 24.38,23.43 24.38,6.76 v1(22.48,4.86)
LEDB: length 27.9
  Top Layer w0.254: 47.62,12.38 47.62,12.12 v1(48.64,11.11)
  Bottom Layer w0.254: v1(33.91,8.7) 33.91,4 35.56,2.35 44.07,2.35 48.64,6.92 v1(48.64,11.11)
LEDG: length 28.6
  Top Layer w0.254: 47.62,16.57 47.62,15.68 v1(47.88,15.43)
  Bottom Layer w0.254: v1(35.31,8.7) 35.31,3.87 35.94,3.23 43.69,3.23 47.88,7.43 v1(47.88,15.43)
LEDR: length 2.3
  Bottom Layer w0.254: v1(36.45,8.7) 36.45,6.41
TGT_NRESET: length 8.8
  Top Layer w0.254: 39.75,12.63 39.88,12.51 40.51,12.51 41.66,11.36 43.18,11.36 44.96,13.14 44.96,15.43
TGT_RX: length 6.1
  Top Layer w0.203: 39.88,18.98 40.22,18.98 41.83,17.37 42.75,17.37 43.85,18.47 H2.8
TGT_SWCLK: length 10.7
  Top Layer w0.203: v1(40.64,16.44) 39.62,16.44
  Bottom Layer w0.203: 44.7,23.43 44.7,22.32 44.5,22.12 44.37,22.12 43.73,21.47 43.73,17.88 43.04,17.19 41.64,17.19 40.89,16.44 v1(40.64,16.44)
TGT_SWDIO: length 18.7
  Top Layer w0.254: v1(40.71,17.59) 39.88,17.59 39.75,17.71 ; 39.37,17.71 37.59,17.71 37.34,17.46 37.34,15.81 37.85,15.3 39.24,15.3
  Bottom Layer w0.203: 45.09,26.35 44.83,26.35 43.39,24.91 43.39,20.52 42.76,19.89 40.89,19.89 40.71,19.71 v1(40.71,17.59)
TGT_SWO: length 14.3
  Top Layer w0.254: v1(41.28,14.23) 40.71,14.23 40.39,13.9 39.24,13.9
  Bottom Layer w0.254: v1(41.28,14.23) 45.92,14.23 46.1,14.41 46.1,20 44.96,21.14
TGT_TX: length 3.3
  Top Layer w0.254: 39.62,20.25 40.39,20.25 42.16,18.47
$3N791: length 1.3
  Top Layer w0.508: 14.44,8.15 14.44,6.95 14.48,6.92
$3N922: length 14.3
  Top Layer w0.254: 12.57,10.6 v1(12.57,11.74) ; 10.41,22.03 9.14,20.76 v1(9.14,20.25)
  Bottom Layer w0.254: v1(12.57,11.74) 10.92,11.74 9.14,13.52 v1(9.14,20.25)
$3N2688: length 3.4
  Top Layer w0.254: 17.65,8.95 17.65,8.7 19.3,7.05 19.3,6.28
$3N4196: length 13.9
  Top Layer w0.254: v1(11,16.07) 9.91,16.07 ; v1(20.45,11.36) 21.84,11.36
  Bottom Layer w0.254: v1(20.45,11.36) 18.41,11.36 13.71,16.07 v1(11,16.07)
$3N4199: length 13.7
  Top Layer w0.254: v1(11,14.54) 9.91,14.54 ; v1(20.45,10.22) 21.84,10.22
  Bottom Layer w0.254: v1(11,14.54) 13.72,14.54 18.03,10.22 v1(20.45,10.22)
$3N4756: length 6.2
  Top Layer w0.254: 39.5,10.09 40.64,10.09 41.91,8.82 45.21,8.82
$3N4867: length 20.1
  Top Layer w0.254: 39.12,22.92 38.99,22.79 v1(37.59,22.79)
  Bottom Layer w0.254: H1.1 35.94,13.9 35.94,21.14 v1(37.59,22.79)
$3N4870: length 15.2
  Top Layer w0.254: v1(37.59,21.52) 39.5,21.52
  Bottom Layer w0.254: v1(37.59,21.52) 37.08,21.02 37.08,15.05 41.78,10.35
$3N5281: length 2.1
  Top Layer w0.254: 25.4,6.54 25.02,6.92 25.02,8.44
$3N6239: length 1.8
  Top Layer w0.254: 8.76,25.21 6.98,25.21
$3N15872: length 6.7
  Top Layer w0.457: 12.19,13.14 11.81,12.76 11.81,8.19 10.92,7.3 10.92,6.92
$3N15883: length 3.9
  Top Layer w0.254: 6.35,13.65 5.84,13.65 4.83,14.67 v1(4.83,15.05)
  Bottom Layer w0.254: 3.56,14.41 4.19,15.05 v1(4.83,15.05)
$3N15888: length 3
  Top Layer w0.254: v1(4.83,15.94) 5.59,16.7 6.1,16.7
  Bottom Layer w0.254: v1(4.83,15.94) 3.43,15.94
$3N17783: length 25.3
  Top Layer w0.254: 47.37,20.63 47.5,20.51 v1(47.5,19.49)
  Bottom Layer w0.254: 36.32,4.76 44.45,4.76 47.12,7.43 47.12,19.11 v1(47.5,19.49)

## Copper pours and planes (outline as drawn; the poured copper is in the pictures)
GND on Top Layer: -2.67,29.65 52.32,29.65 52.32,-1.59 -2.67,-1.59
GND on Bottom Layer: -4.83,30.67 53.85,30.67 53.85,-3.37 -4.83,-3.37
VCC on Top Layer: 18.29,18.73 19.81,18.73 19.81,16.82 18.29,16.82
VCC on Bottom Layer: 17.91,13.27 17.4,13.78 17.4,24.85 20.55,28 42.93,28 43.56,27.36 43.56,25.38 43.09,24.91 22.19,24.91 21.21,23.94 21.21,13.9 20.57,13.27
VCC on Bottom Layer: 11,28 20.35,28 20.35,24.95 11,24.95
VCC on Bottom Layer: 16.26,26.22 18.03,26.22 18.03,23.65 16.26,23.65

## Text on the board
Top Silkscreen Layer: R G B
